# EAGLE design ALU-AB (EAGLE 9.6.2)
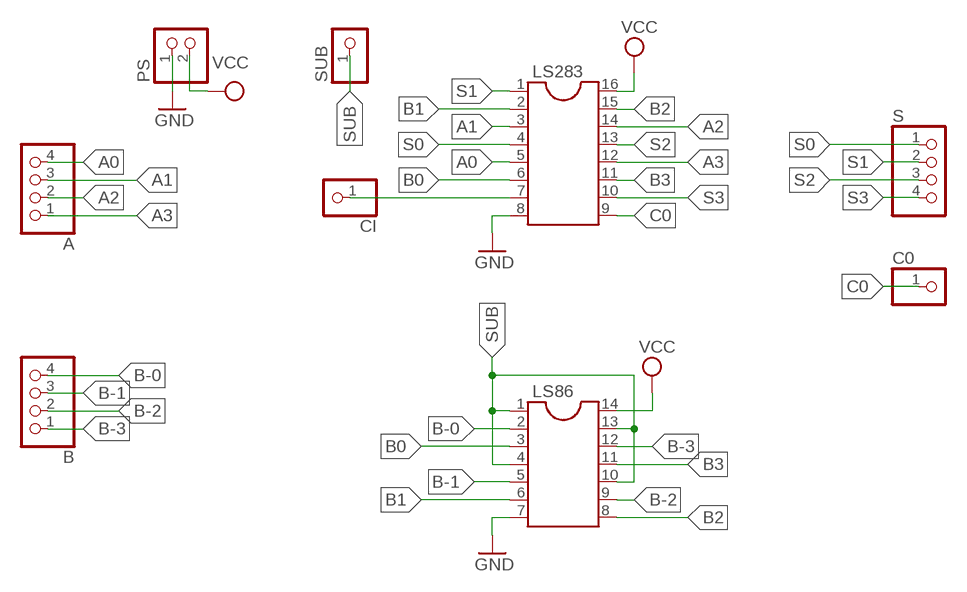
[diagram p0: schematic, sheet 1]

## Parts
A  PINHD-1X4  [1X04]
B  PINHD-1X4  [1X04]
C0  PINHD-1X1  [1X01]
CI  PINHD-1X1  [1X01]
LS86  DIL14S  [SOCKET-14]
LS283  DIL16S  [SOCKET-16]
PS  PINHD-1X2  [1X02]
S  PINHD-1X4  [1X04]
SUB  PINHD-1X1  [1X01]

## Nets
A0: A.4 LS283.5
A1: A.3 LS283.3
A2: A.2 LS283.14
A3: A.1 LS283.12
B0: LS86.3 LS283.6
B1: LS86.6 LS283.2
B2: LS86.8 LS283.15
B3: LS86.11 LS283.11
B-0: B.4 LS86.2
B-1: B.3 LS86.5
B-2: B.2 LS86.9
B-3: B.1 LS86.12
C0: C0.1 LS283.9
CI: CI.1 LS283.7
GND: LS86.7 LS283.8 PS.1
S0: LS283.4 S.1
S1: LS283.1 S.2
S2: LS283.13 S.3
S3: LS283.10 S.4
SUB: LS86.1 LS86.4 LS86.10 LS86.13 SUB.1
VCC: LS86.14 LS283.16 PS.2

## Library data of the parts
A B S = pinhead:PINHD-1X4: PIN HEADER
C0 CI SUB = pinhead:PINHD-1X1: PIN HEADER
LS86 = ic-package:DIL14: Dual In Line / Socket
LS283 = ic-package:DIL16: Dual In Line / Socket
PS = pinhead:PINHD-1X2: PIN HEADER

## Board
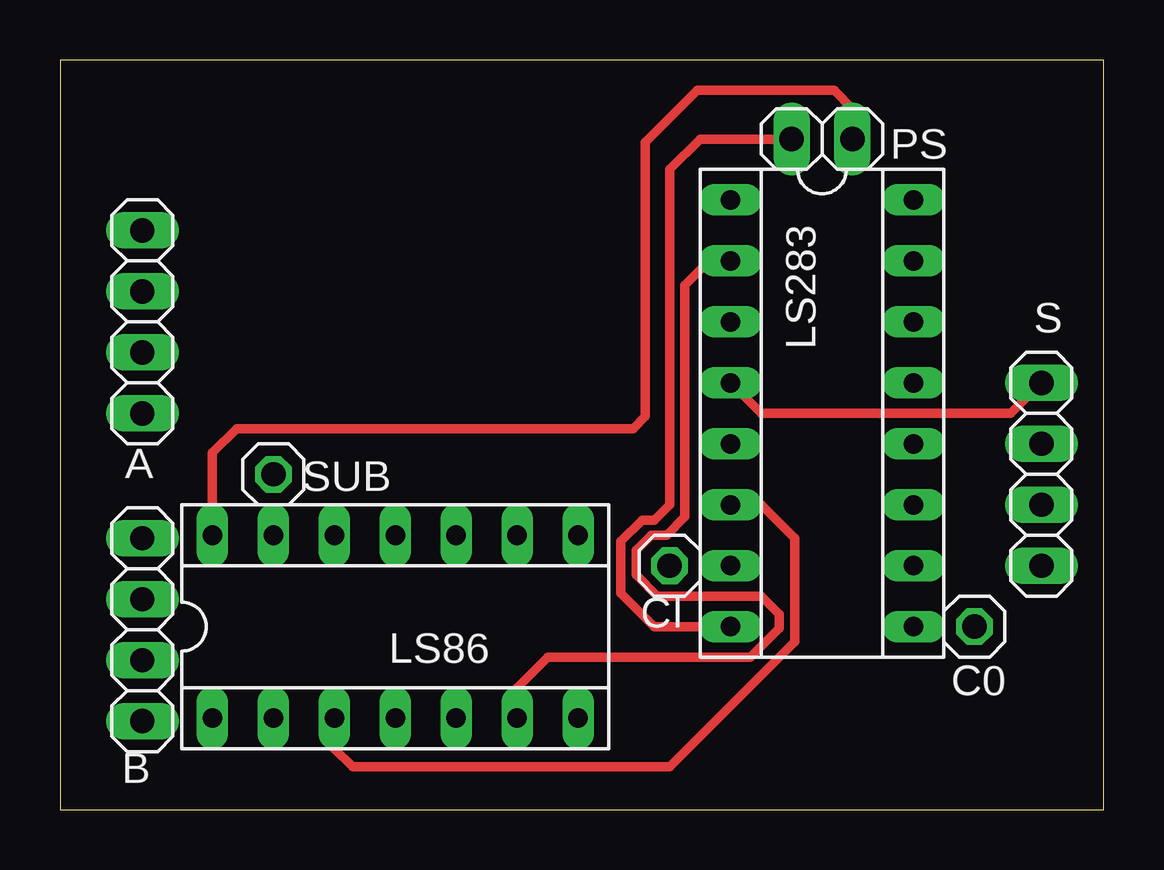
[diagram p1: board, top side]
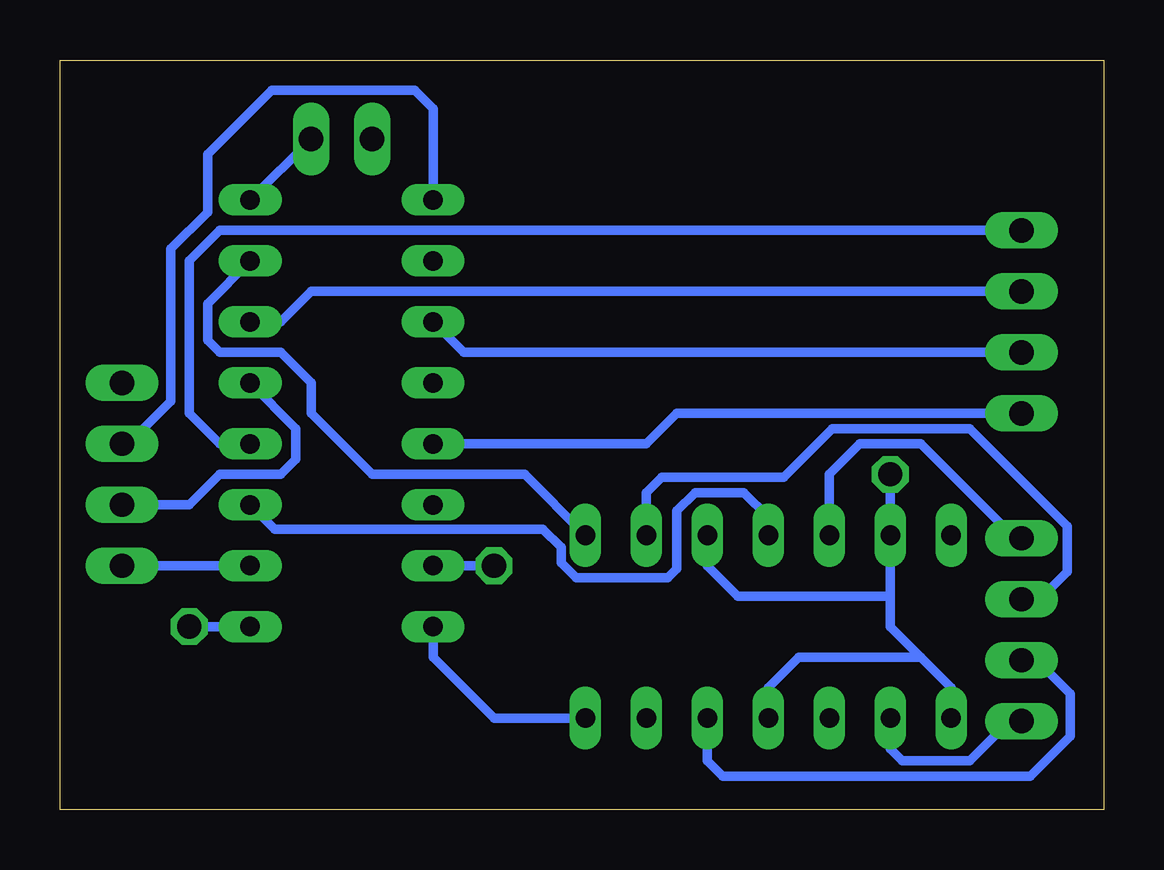
[diagram p2: board, bottom side, seen from below]

Size 43.48 x 31.23 mm. Coordinates in mm from the lower left corner, seen from the top.
Outline: 0,0 43.48,0 43.48,31.23 0,31.23 0,0
Copper layers (1*16): Top 0.035mm / dielectric 1.5mm / Bottom 0.035mm
Design rules "default": minimum track width 6mil, minimum drill 0.35mm, track to track 6mil, track to pad 6mil, pad to pad 6mil, via to via 6mil, smd to smd 6mil, copper to edge 40mil, drill to drill 6mil, minimum pad ring 10mil, minimum via ring 8mil, stop-mask expansion 4mil, vias tented up to drill 0mil, thermal gap 10mil

### Footprints (pad centres in the part's own frame; a part is rotated, then mirrored left to right if it is on the bottom)
1X04 = drill 1.016 long: 1 -3.81,0; 2 -1.27,0; 3 1.27,0; 4 3.81,0
1X01 = drill 1.016 octagon: 1 0,0
SOCKET-14 = drill 0.813 long: 1 -7.62,-3.81; 2 -5.08,-3.81; 3 -2.54,-3.81; 4 0,-3.81; 5 2.54,-3.81; 6 5.08,-3.81; 7 7.62,-3.81; 8 7.62,3.81; 9 5.08,3.81; 10 2.54,3.81; 11 0,3.81; 12 -2.54,3.81; 13 -5.08,3.81; 14 -7.62,3.81
SOCKET-16 = drill 0.813 long: 1 -8.89,-3.81; 2 -6.35,-3.81; 3 -3.81,-3.81; 4 -1.27,-3.81; 5 1.27,-3.81; 6 3.81,-3.81; 7 6.35,-3.81; 8 8.89,-3.81; 9 8.89,3.81; 10 6.35,3.81; 11 3.81,3.81; 12 1.27,3.81; 13 -1.27,3.81; 14 -3.81,3.81; 15 -6.35,3.81; 16 -8.89,3.81
1X02 = drill 1.016 long: 1 -1.27,0; 2 1.27,0

### Placement (x,y rotation side)
A  3.43,20.32 270 top
B  3.43,7.49 270 top
C0  38.1,7.62 0 top
CI  25.4,10.16 0 top
LS86  13.97,7.62 0 top
LS283  31.75,16.51 270 top
PS  31.75,27.94 0 top
S  40.89,13.97 270 top
SUB  8.89,13.97 0 top

### Tracks (layer width: path | path; a pad name or v marks a point on that pad's centre or on a via)
A0
  Bottom 0.4: LS283.5 19.05,15.24 17.78,16.51 A.4
A1
  Bottom 0.4: LS283.3 26.67,19.05 A.3
A2
  Bottom 0.4: LS283.14 34.29,20.32 33.02,21.59 A.2
A3
  Bottom 0.4: LS283.12 36.83,15.24 38.1,16.51 38.1,22.86 36.83,24.13 A.1
B0
  Top 0.4: LS86.3 11.43,2.54 12.19,1.78 25.4,1.78 30.61,6.99 30.61,11.3 29.21,12.7 LS283.6
B1
  Top 0.4: LS86.6 19.05,5.08 20.32,6.35 28.76,6.35 29.97,7.56 29.97,8.13 29.21,8.89 24.89,8.89 24,9.78 24,10.79 24.64,11.43 25.27,11.43 26.04,12.19 26.04,21.84 27.05,22.86 LS283.2
B2
  Bottom 0.4: LS283.15 37.34,21.08 37.34,19.56 36.83,19.05 34.29,19.05 33.02,17.78 33.02,16.51 30.48,13.97 24.13,13.97 LS86.8
B3
  Bottom 0.4: LS86.11 13.97,12.19 14.99,13.21 17.02,13.21 17.78,12.45 17.78,10.03 18.16,9.65 21.97,9.65 22.61,10.29 22.61,10.92 23.37,11.68 34.54,11.68 LS283.11
B-0
  Bottom 0.4: LS86.2 8.89,2.54 8.38,2.03 5.59,2.03 3.94,3.68 B.4
B-1
  Bottom 0.4: LS86.5 16.51,2.03 15.88,1.4 3.05,1.4 1.4,3.05 1.4,4.83 2.79,6.22 B.3
B-2
  Bottom 0.4: B.2 2.67,8.76 1.52,9.91 1.52,11.81 5.59,15.88 11.3,15.88 13.34,13.84 18.41,13.84 19.05,13.21 LS86.9
B-3
  Bottom 0.4: B.1 3.68,11.3 7.62,15.24 10.16,15.24 11.43,13.97 LS86.12
C0
  Bottom 0.4: LS283.9 C0.1
CI
  Bottom 0.4: CI.1 LS283.7
GND
  Top 0.4: PS.1 26.67,27.94 25.4,26.67 25.4,12.7 24.77,12.06 24.26,12.06 23.37,11.18 23.37,9.02 24.77,7.62 LS283.8
  Bottom 0.4: LS86.7 25.4,3.81 27.94,6.35 LS283.8
S0
  Top 0.4: LS283.4 29.21,16.51 39.62,16.51 S.1
S1
  Bottom 0.4: S.2 40.64,15.24 38.86,17.02 38.86,23.37 37.34,24.89 37.34,27.3 34.67,29.97 28.7,29.97 27.94,29.21 LS283.1
S2
  Bottom 0.4: S.3 38.1,12.7 36.83,13.97 34.29,13.97 33.66,14.61 33.66,15.88 LS283.13
S3
  Bottom 0.4: LS283.10 S.4
SUB
  Bottom 0.4: SUB.1 LS86.13 8.89,8.89 | LS86.1 6.35,5.08 7.62,6.35 | 8.89,8.89 8.89,7.62 7.62,6.35 | 7.62,6.35 12.7,6.35 13.97,5.08 LS86.4 | 8.89,8.89 15.24,8.89 16.51,10.16 LS86.10
VCC
  Top 0.4: LS86.14 6.35,14.86 7.37,15.88 23.88,15.88 24.38,16.38 24.38,27.81 26.54,29.97 32.26,29.97 33.02,29.21 PS.2
  Bottom 0.4: PS.2 LS283.16